# Altium schematic sheet Aixcel_Tiny_STLink_Board_Diagram.SchDoc
size A4; Organization: Altium Limited; Address1: L3, 12a Rodborough Rd; Address2: Frenchs Forest; Address3: NSW; Address4: Australia 2086; DocumentNumber: 01; Revision: 01; SheetNumber: 2; SheetTotal: 4
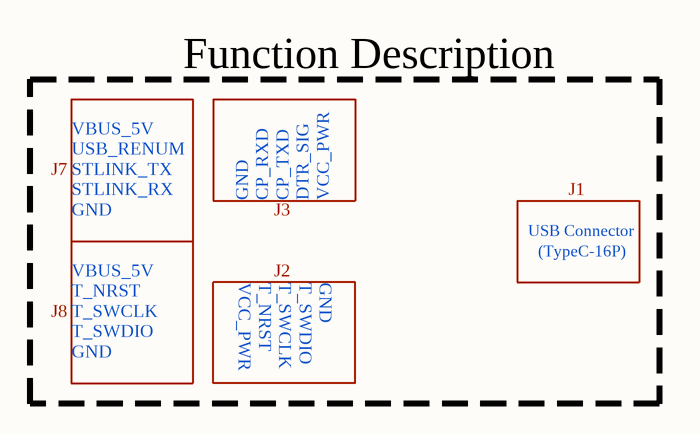
[diagram p0: Aixcel_Tiny_STLink_Board_Diagram.SchDoc]

## Notes on the sheet
- Function Description
- J7
- GND
- STLINK_RX
- USB_RENUM
- STLINK_TX
- VBUS_5V
- J3
- CP_RXD
- CP_TXD
- DTR_SIG
- VCC_PWR
- J1
- J8
- T_NRST
- T_SWCLK
- J2
- T_SWDIO
- USB Connector
- (TypeC-16P)
- Size:
- Model Name:
- A4
- Number:
- Revision:
- Aixcel Limited
- Guass Rd At Pudong
- ShangHai China +86
- Date:
- Time:
- Sheet
- of
- www.Aixcel.net <http://www.Aixcel.net>